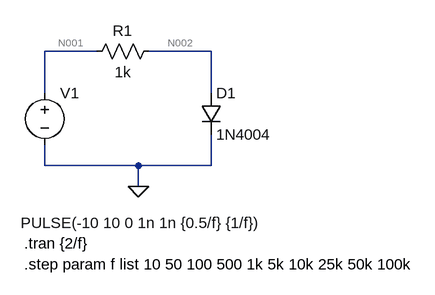
[diagram p0: schematic Diodo4004_2.asc]
Diodo4004_2.asc, the LTspice schematic file:
Version 4.1
SHEET 1 880 680
WIRE 160 80 80 80
WIRE 336 80 240 80
WIRE 80 144 80 80
WIRE 336 144 336 80
WIRE 80 256 80 224
WIRE 224 256 80 256
WIRE 336 256 336 208
WIRE 336 256 224 256
WIRE 224 288 224 256
FLAG 224 288 0
SYMBOL voltage 80 128 R0
WINDOW 3 -37 216 Left 2
WINDOW 123 0 0 Left 0
WINDOW 39 0 0 Left 0
SYMATTR Value PULSE(-10 10 0 1n 1n {0.5/f} {1/f})
SYMATTR InstName V1
SYMBOL res 256 64 R90
WINDOW 0 0 56 VBottom 2
WINDOW 3 32 56 VTop 2
SYMATTR InstName R1
SYMATTR Value 1k
SYMBOL diode 320 144 R0
SYMATTR InstName D1
SYMATTR Value 1N4004
TEXT 48 376 Left 2 !.tran {2/f}
TEXT 48 408 Left 2 !.step param f list 10 50 100 500 1k 5k 10k 25k 50k 100k

The netlist it stands for:
* Diodo4004_2.asc
V1 N001 0 PULSE(-10 10 0 1n 1n {0.5/f} {1/f})
R1 N002 N001 1k
D1 N002 0 1N4004
.model D D
.lib standard.dio
.tran {2/f}
.step param f list 10 50 100 500 1k 5k 10k 25k 50k 100k
.backanno
.end

* Results of the author's LTspice run, read from the files saved beside the schematic
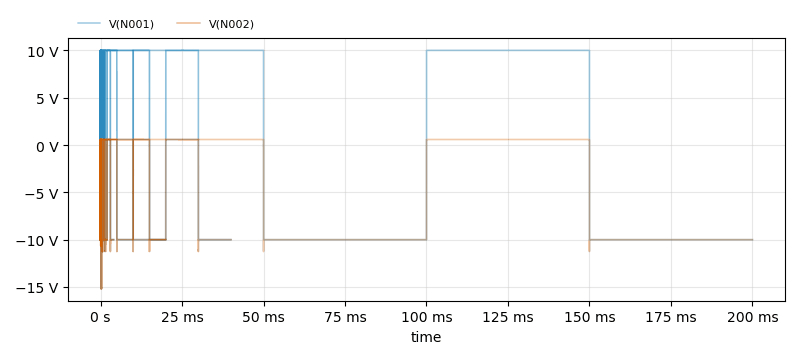
[diagram p1: Transient Analysis of Diodo4004_2.asc, plotted from the saved traces]
* Transient Analysis, 10 runs:
*   V(N001) [run 1]: min -10 V, max 10 V, average 0 V, rms 10 V, last -10 V
*   V(N001) [run 2]: min -10 V, max 10 V, average 0 V, rms 10 V, last -10 V
*   V(N001) [run 3]: min -10 V, max 10 V, average 2 µV, rms 10 V, last -10 V
*   V(N001) [run 4]: min -10 V, max 10 V, average 10 µV, rms 10 V, last -10 V
*   V(N001) [run 5]: min -10 V, max 10 V, average 20 µV, rms 10 V, last -10 V
*   V(N001) [run 6]: min -10 V, max 10 V, average 100 µV, rms 10 V, last -10 V
*   V(N001) [run 7]: min -10 V, max 10 V, average 200 µV, rms 10 V, last -10 V
*   V(N001) [run 8]: min -10 V, max 10 V, average 500 µV, rms 10 V, last -10 V
*   V(N002) [run 1]: min -11.25 V, max 584.8 mV, average -4.707 V, rms 7.083 V, last -10 V
*   V(N002) [run 2]: min -11.25 V, max 584.8 mV, average -4.707 V, rms 7.083 V, last -9.999 V
*   V(N002) [run 3]: min -11.25 V, max 584.8 mV, average -4.706 V, rms 7.082 V, last -10 V
*   V(N002) [run 4]: min -11.25 V, max 584.8 mV, average -4.701 V, rms 7.078 V, last -10 V
*   V(N002) [run 5]: min -11.25 V, max 584.7 mV, average -4.694 V, rms 7.074 V, last -10 V
*   V(N002) [run 6]: min -15.19 V, max 584.7 mV, average -4.641 V, rms 7.038 V, last -10 V
*   V(N002) [run 7]: min -10.65 V, max 584.7 mV, average -4.573 V, rms 6.991 V, last -10 V
*   V(N002) [run 8]: min -10 V, max 584.7 mV, average -4.372 V, rms 6.85 V, last -10 V